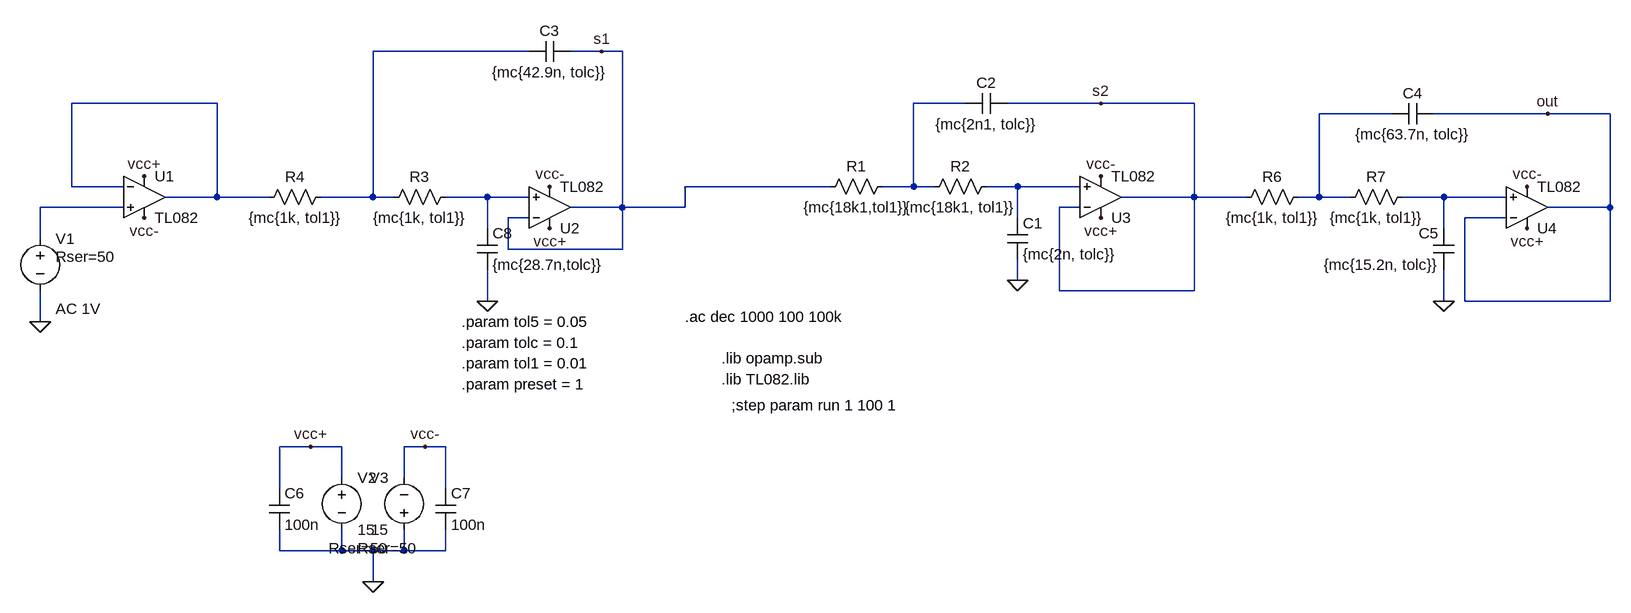
[diagram p0: schematic tc_tp5_ej1_bes6.asc]
tc_tp5_ej1_bes6.asc, the LTspice schematic file:
Version 4
SHEET 1 1312 724
WIRE -384 -112 -624 -112
WIRE -272 -112 -320 -112
WIRE -240 -112 -272 -112
WIRE -864 -32 -1088 -32
WIRE 288 -32 208 -32
WIRE 496 -32 352 -32
WIRE 640 -32 496 -32
WIRE 944 -16 832 -16
WIRE 1184 -16 1008 -16
WIRE 1280 -16 1184 -16
WIRE -1088 96 -1088 -32
WIRE -1008 96 -1088 96
WIRE 80 96 -144 96
WIRE 208 96 208 -32
WIRE 208 96 160 96
WIRE 240 96 208 96
WIRE 368 96 320 96
WIRE 464 96 368 96
WIRE -864 112 -864 -32
WIRE -864 112 -944 112
WIRE -784 112 -864 112
WIRE -624 112 -624 -112
WIRE -624 112 -704 112
WIRE -592 112 -624 112
WIRE -448 112 -512 112
WIRE -384 112 -448 112
WIRE 640 112 640 -32
WIRE 640 112 528 112
WIRE 720 112 640 112
WIRE 832 112 832 -16
WIRE 832 112 800 112
WIRE 880 112 832 112
WIRE 1024 112 960 112
WIRE 1120 112 1024 112
WIRE -1008 128 -1136 128
WIRE -240 128 -240 -112
WIRE -240 128 -320 128
WIRE -144 128 -144 96
WIRE -144 128 -240 128
WIRE 464 128 432 128
WIRE 1280 128 1280 -16
WIRE 1280 128 1184 128
WIRE -384 144 -416 144
WIRE 368 144 368 96
WIRE 1120 144 1056 144
WIRE -448 160 -448 112
WIRE 1024 160 1024 112
WIRE -1136 176 -1136 128
WIRE -416 192 -416 144
WIRE -240 192 -240 128
WIRE -240 192 -416 192
WIRE 368 240 368 208
WIRE 432 256 432 128
WIRE 640 256 640 112
WIRE 640 256 432 256
WIRE -448 272 -448 224
WIRE 1024 272 1024 224
WIRE 1056 272 1056 144
WIRE 1280 272 1280 128
WIRE 1280 272 1056 272
WIRE -1136 304 -1136 256
WIRE -720 496 -768 496
WIRE -672 496 -720 496
WIRE -544 496 -576 496
WIRE -512 496 -544 496
WIRE -672 544 -672 496
WIRE -576 544 -576 496
WIRE -768 560 -768 496
WIRE -512 560 -512 496
WIRE -768 656 -768 624
WIRE -672 656 -672 624
WIRE -672 656 -768 656
WIRE -624 656 -672 656
WIRE -576 656 -576 624
WIRE -576 656 -624 656
WIRE -512 656 -512 624
WIRE -512 656 -576 656
WIRE -624 704 -624 656
FLAG -1136 304 0
FLAG 368 240 0
FLAG 1024 272 0
FLAG -624 704 0
FLAG -720 496 vcc+
FLAG -976 80 vcc+
FLAG 496 144 vcc+
FLAG -544 496 vcc-
FLAG 496 80 vcc-
FLAG -976 144 vcc-
FLAG 1152 160 vcc+
FLAG 1152 96 vcc-
FLAG -448 272 0
FLAG -352 96 vcc-
FLAG -352 160 vcc+
FLAG 1184 -16 out
FLAG 496 -32 s2
FLAG -272 -112 s1
SYMBOL res 176 80 R90
WINDOW 0 0 56 VBottom 2
WINDOW 3 32 56 VTop 2
SYMATTR InstName R1
SYMATTR Value {mc{18k1,tol1}}
SYMBOL res 336 80 R90
WINDOW 0 0 56 VBottom 2
WINDOW 3 32 56 VTop 2
SYMATTR InstName R2
SYMATTR Value {mc{18k1, tol1}}
SYMBOL cap 352 144 R0
SYMATTR InstName C1
SYMATTR Value {mc{2n, tolc}}
SYMBOL cap 352 -48 R90
WINDOW 0 0 32 VBottom 2
WINDOW 3 32 32 VTop 2
SYMATTR InstName C2
SYMATTR Value {mc{2n1, tolc}}
SYMBOL voltage -1136 160 R0
WINDOW 123 24 124 Left 2
WINDOW 39 24 44 Left 2
SYMATTR Value2 AC 1V
SYMATTR SpiceLine Rser=50
SYMATTR InstName V1
SYMATTR Value ""
SYMBOL res -496 96 R90
WINDOW 0 0 56 VBottom 2
WINDOW 3 32 56 VTop 2
SYMATTR InstName R3
SYMATTR Value {mc{1k, tol1}}
SYMBOL res -688 96 R90
WINDOW 0 0 56 VBottom 2
WINDOW 3 32 56 VTop 2
SYMATTR InstName R4
SYMATTR Value {mc{1k, tol1}}
SYMBOL cap -320 -128 R90
WINDOW 0 0 32 VBottom 2
WINDOW 3 32 32 VTop 2
SYMATTR InstName C3
SYMATTR Value {mc{42.9n, tolc}}
SYMBOL res 816 96 R90
WINDOW 0 0 56 VBottom 2
WINDOW 3 32 56 VTop 2
SYMATTR InstName R6
SYMATTR Value {mc{1k, tol1}}
SYMBOL res 976 96 R90
WINDOW 0 0 56 VBottom 2
WINDOW 3 32 56 VTop 2
SYMATTR InstName R7
SYMATTR Value {mc{1k, tol1}}
SYMBOL cap 1008 -32 R90
WINDOW 0 0 32 VBottom 2
WINDOW 3 32 32 VTop 2
SYMATTR InstName C4
SYMATTR Value {mc{63.7n, tolc}}
SYMBOL cap 1040 224 R180
WINDOW 0 24 56 Left 2
WINDOW 3 24 8 Left 2
SYMATTR InstName C5
SYMATTR Value {mc{15.2n, tolc}}
SYMBOL Opamps\\opamp2 -976 48 R0
SYMATTR InstName U1
SYMATTR Value TL082
SYMBOL Opamps\\opamp2 -352 192 M180
SYMATTR InstName U2
SYMATTR Value TL082
SYMBOL Opamps\\opamp2 496 176 M180
SYMATTR InstName U3
SYMATTR Value TL082
SYMBOL Opamps\\opamp2 1152 192 M180
SYMATTR InstName U4
SYMATTR Value TL082
SYMBOL cap -784 560 R0
SYMATTR InstName C6
SYMATTR Value 100n
SYMBOL cap -528 560 R0
SYMATTR InstName C7
SYMATTR Value 100n
SYMBOL voltage -672 528 R0
WINDOW 123 0 0 Left 0
WINDOW 39 24 124 Left 2
SYMATTR SpiceLine Rser=50
SYMATTR InstName V2
SYMATTR Value 15
SYMBOL voltage -576 640 R180
WINDOW 0 24 96 Left 2
WINDOW 3 24 16 Left 2
WINDOW 123 0 0 Left 0
WINDOW 39 24 -12 Left 2
SYMATTR InstName V3
SYMATTR Value 15
SYMATTR SpiceLine Rser=50
SYMBOL cap -464 160 R0
SYMATTR InstName C8
SYMATTR Value {mc{28.7n,tolc}}
TEXT -144 296 Left 2 !.ac dec 1000 100 100k
TEXT -88 360 Left 2 !.lib opamp.sub
TEXT -488 304 Left 2 !.param tol5 = 0.05
TEXT -488 336 Left 2 !.param tolc = 0.1
TEXT -488 368 Left 2 !.param tol1 = 0.01
TEXT -88 392 Left 2 !.lib TL082.lib
TEXT -72 432 Left 2 !;step param run 1 100 1
TEXT -488 400 Left 2 !.param preset = 1

The netlist it stands for:
* tc_tp5_ej1_bes6.asc
R1 N003 s1 {mc{18k1,tol1}}
R2 N005 N003 {mc{18k1, tol1}}
C1 N005 0 {mc{2n, tolc}}
C2 s2 N003 {mc{2n1, tolc}}
V1 N008 0 AC 1V Rser=50
R3 N006 N001 {mc{1k, tol1}}
R4 N001 N002 {mc{1k, tol1}}
C3 s1 N001 {mc{42.9n, tolc}}
R6 N004 s2 {mc{1k, tol1}}
R7 N007 N004 {mc{1k, tol1}}
C4 out N004 {mc{63.7n, tolc}}
C5 0 N007 {mc{15.2n, tolc}}
XU1 N008 N002 vcc+ vcc- N002 TL082  ; pins In+ In- V+ V- OUT
XU2 N006 s1 vcc+ vcc- s1 TL082  ; pins In+ In- V+ V- OUT
XU3 N005 s2 vcc+ vcc- s2 TL082  ; pins In+ In- V+ V- OUT
XU4 N007 out vcc+ vcc- out TL082  ; pins In+ In- V+ V- OUT
C6 vcc+ 0 100n
C7 vcc- 0 100n
V2 vcc+ 0 15 Rser=50
V3 0 vcc- 15 Rser=50
C8 N006 0 {mc{28.7n,tolc}}
.ac dec 1000 100 100k
.lib opamp.sub
.param tol5 = 0.05
.param tolc = 0.1
.param tol1 = 0.01
.lib TL082.lib
;step param run 1 100 1
.param preset = 1
.backanno
.end